# Altium schematic sheet Programmable_Gain_Amp.SchDoc
size A; SheetNumber: 6; SheetTotal: 16
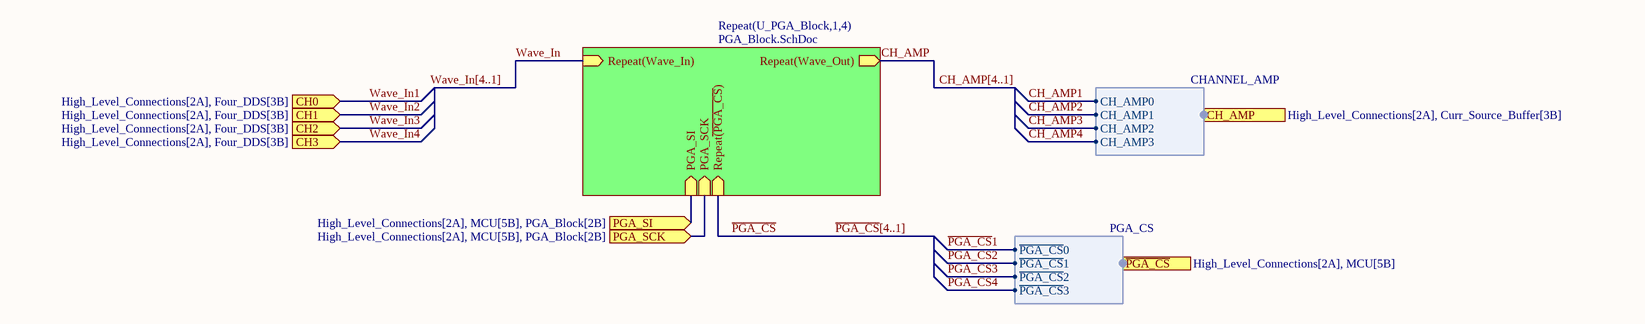
[diagram p0: Programmable_Gain_Amp.SchDoc]

## Sub-sheets
Repeat(U_PGA_Block,1,4) = PGA_Block.SchDoc: Repeat(Wave_In) (in), Repeat(Wave_Out) (out), PGA_SI (in), PGA_SCK (in), Repeat~{(PGA_CS}) (in)

## Ports
CH0 (in, see High_Level_Connections[2A], Four_DDS[3B]), CH1 (in, see High_Level_Connections[2A], Four_DDS[3B]), CH2 (in, see High_Level_Connections[2A], Four_DDS[3B]), CH3 (in, see High_Level_Connections[2A], Four_DDS[3B]), CH_AMP (in, harness CHANNEL_AMP, see High_Level_Connections[2A], Curr_Source_Buffer[3B]), PGA_SCK (in, see High_Level_Connections[2A], MCU[5B], PGA_Block[2B]), PGA_SI (in, see High_Level_Connections[2A], MCU[5B], PGA_Block[2B]), ~{PGA_CS} (in, harness PGA_CS, see High_Level_Connections[2A], MCU[5B])

## Harnesses
PGA_CS: ~{PGA_CS}0, ~{PGA_CS}1, ~{PGA_CS}2, ~{PGA_CS}3
CHANNEL_AMP: CH_AMP0, CH_AMP1, CH_AMP2, CH_AMP3

## Nets
~{PGA_CS}: sheet Repeat(U_PGA_Block,1,4)/Repeat~{(PGA_CS})
~{PGA_CS}1: port ~{PGA_CS}.~{PGA_CS}0
~{PGA_CS}2: port ~{PGA_CS}.~{PGA_CS}1
~{PGA_CS}3: port ~{PGA_CS}.~{PGA_CS}2
~{PGA_CS}4: port ~{PGA_CS}.~{PGA_CS}3
CH_AMP: sheet Repeat(U_PGA_Block,1,4)/Repeat(Wave_Out)
CH_AMP1: port CH_AMP.CH_AMP0
CH_AMP2: port CH_AMP.CH_AMP1
CH_AMP3: port CH_AMP.CH_AMP2
CH_AMP4: port CH_AMP.CH_AMP3
PGA_SCK: port PGA_SCK, sheet Repeat(U_PGA_Block,1,4)/PGA_SCK
PGA_SI: port PGA_SI, sheet Repeat(U_PGA_Block,1,4)/PGA_SI
Wave_In: sheet Repeat(U_PGA_Block,1,4)/Repeat(Wave_In)
Wave_In1: port CH0
Wave_In2: port CH1
Wave_In3: port CH2
Wave_In4: port CH3

## Buses and harness runs
bus CH_AMP[4..1]
bus Wave_In[4..1]
bus ~{PGA_CS}[4..1]